# Altium schematic sheet OBDII-Ist.SchDoc
size A4; PageSetup: Record=PageOptions|CenterHorizontal=True|CenterVertical=True|PrintScale=1.00|XCorrection=1.00|YCorrection=1.00|PrintKind=1|BorderSize=5000000|LeftOffset=0|BottomOffset=0|Orientation=2|PaperLength=1000|PaperWidth=1000|Scale=100|PaperSource=15|PrintQuality=1200|MediaType=1|DitherType=10|PaperKind=A4|PrintScaleMode=1
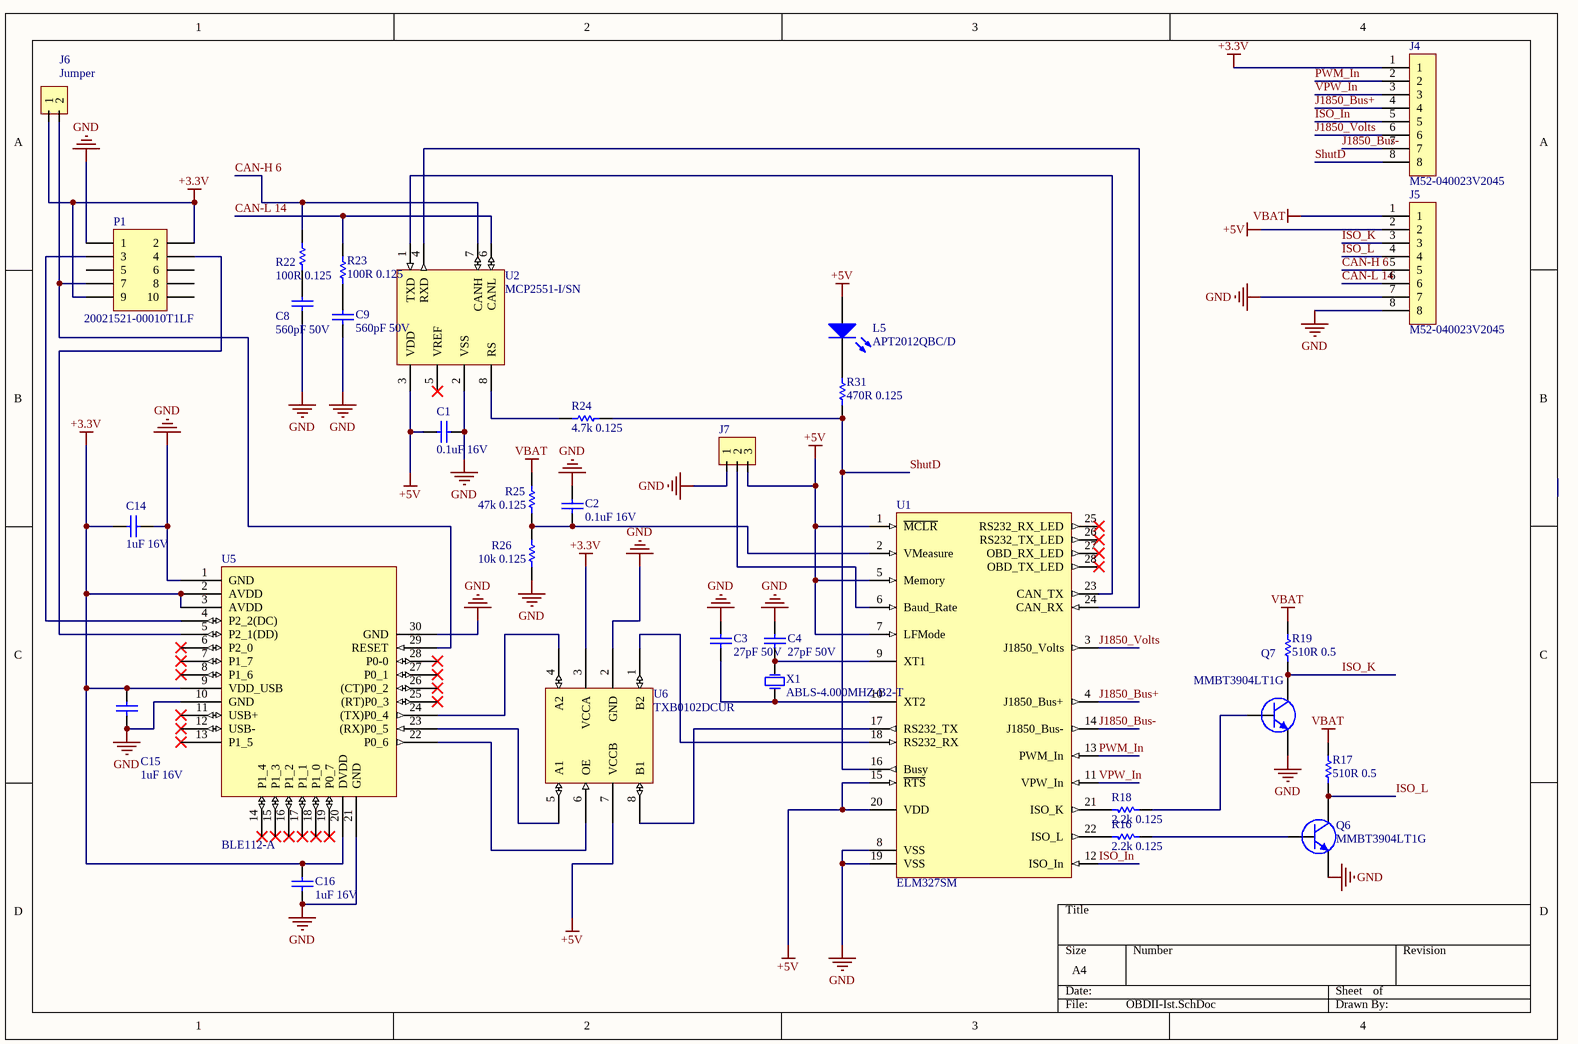
[diagram p0: OBDII-Ist.SchDoc]

## Parts
C1  0.1uF 16V  [1608[0603]]
C2  0.1uF 16V  [1608[0603]]
C3  27pF 50V  [1608[0603]]
C4  27pF 50V  [1608[0603]]
C8  560pF 50V  [0402]
C9  560pF 50V  [0402]
C14  1uF 16V  [1608[0603]]
C15  1uF 16V  [1608[0603]]
C16  1uF 16V  [1608[0603]]
J4  M52-040023V2045  [M52-040023V2045_hols]
J5  M52-040023V2045  [M52-040023V2045_hols]
J6  Jumper  [Jumper]
J7  Solder Junper Switcher  [Jumper-3]  (value not drawn)
L5  APT2012QBC/D  [LED-0805]
P1  20021521-00010T1LF  [20021521-00010T1LF]
Q6  MMBT3904LT1G  [SOT23]
Q7  MMBT3904LT1G  [SOT23]
R16  2.2k 0.125  [ERA-0805]
R17  510R 0.5  [ERJ-1210]
R18  2.2k 0.125  [ERA-0805]
R19  510R 0.5  [ERJ-1210]
R22  100R 0.125  [ERA-0805]
R23  100R 0.125  [ERA-0805]
R24  4.7k 0.125  [ERA-0805]
R25  47k 0.125  [ERA-0805]
R26  10k 0.125  [ERA-0805]
R31  470R 0.125  [ERA-0805]
U1  ELM327SM  [SOIC-28N]
U2  MCP2551-I/SN  [SOIC8N]
U5  BLE112-A  [BLE112-A - II]
U6  TXB0102DCUR  [TXB0102DCUR]
X1  ABLS-4.000MHZ-B2-T  [HC-49/US]

## Nets
+3.3V: C14.1 C15.2 C16.2 J4.1 J6.1 P1.2 P1.9 U5.2(AVDD) U5.3(AVDD) U5.9(VDD_USB) U5.20(DVDD) U6.3(VCCA)
+5V: C1.1 J5.2 J7.3 L5.1(A) U1.1(~{MCLR}) U1.5(Memory) U1.7(LFMode) U1.15(~{RTS}) U1.20(VDD) U2.3(VDD) U6.7(VCCB)
GND: C1.2 C2.2 C3.2 C4.2 C8.1 C9.1 C14.2 C15.1 C16.1 J5.7 J5.8 J7.1 P1.1 Q6.2(E) Q7.2(E) R26.1 U1.8(VSS) U1.19(VSS) U2.2(VSS) U5.1(GND) U5.10(GND) U5.21(GND) U5.30(GND) U6.2(GND)
VBAT: J5.1 R17.2 R19.2 R25.2
CAN-H 6: J5.5 R22.2 U2.7(CANH)
CAN-L 14: J5.6 R23.2 U2.6(CANL)
ISO_In: J4.5 U1.12(ISO_In)
ISO_K: J5.3 Q7.3(C) R19.1
ISO_L: J5.4 Q6.3(C) R17.1
J1850_Bus+: J4.4 U1.4(J1850_Bus+)
J1850_Bus-: J4.7 U1.14(J1850_Bus-)
J1850_Volts: J4.6 U1.3(J1850_Volts)
PWM_In: J4.2 U1.13(PWM_In)
ShutD: J4.8 R24.2 R31.1 U1.16(Busy)
VPW_In: J4.3 U1.11(VPW_In)
NetC2_1: C2.1 R25.1 R26.2 U1.2(VMeasure)
NetC3_1: C3.1 U1.10(XT2) X1.1(OSC1)
NetC4_1: C4.1 U1.9(XT1) X1.2(OSC2)
NetC8_2: C8.2 R22.1
NetC9_2: C9.2 R23.1
NetJ6_2: J6.2 P1.7 U5.29(RESET)
NetJ7_2: J7.2 U1.6(Baud_Rate)
NetL5_2: L5.2(K) R31.2
NetP1_3: P1.3 U5.4(P2_2(DC))
NetP1_4: P1.4 U5.5(P2_1(DD))
NetQ6_1: Q6.1(B) R16.1
NetQ7_1: Q7.1(B) R18.1
NetR16_2: R16.2 U1.22(ISO_L)
NetR18_2: R18.2 U1.21(ISO_K)
NetR24_1: R24.1 U2.8(RS)
NetU1_17: U1.17(RS232_TX) U6.8(B1)
NetU1_18: U1.18(RS232_RX) U6.1(B2)
NetU1_23: U1.23(CAN_TX) U2.1(TXD)
NetU1_24: U1.24(CAN_RX) U2.4(RXD)
NetU5_22: U5.22(P0_6) U6.6(OE)
NetU5_23: U5.23((RX)P0_5) U6.5(A1)
NetU5_24: U5.24((TX)P0_4) U6.4(A2)

Not connected (* = marked no-connect by the designer): P1 5 6 8 10; U1 25(RS232_RX_LED)* 26(RS232_TX_LED)* 27(OBD_RX_LED)* 28(OBD_TX_LED)*; U2 5(VREF)*; U5 6(P2_0)* 7(P1_7)* 8(P1_6)* 11(USB+)* 12(USB-)* 13(P1_5)* 14(P1_4)* 15(P1_3)* 16(P1_2)* 17(P1_1)* 18(P1_0)* 19(P0_7)* 25((RT)P0_3)* 26((CT)P0_2)* 27(P0_1)* 28(P0-0)*

## Library data of the parts
C1 C2 = GRM188R61C104KA01D: Surface-Mount Ceramic Multilayer Capacitor, 0.1uF, X5R, 10% Tolerance, 0603 Size, 16V; PackageReference: 0603; Publisher: Altium Limited; PackageDescription: Chip Capacitor; Site: http://product.tdk.com/capacitor/mlcc/en/documents/mlccspec_automotive_general_midvoltage_en.pdf; Value: 0.1uF 16V
C3 C4 = CC0603JRNPO9BN270: Surface-Mount Ceramic Multilayer Capacitor, 27pF, 5% Tolerance, 0603 Size, 50V; PackageReference: 1608(0603); Publisher: Altium Limited; PackageDescription: Chip Capacitor; Site: http://www.mouser.com/ds/2/447/UPY-GP_NP0_16V-to-50V_%288%29-217813.pdf; Value: 27pF 50V
C8 C9 = C0402C561J5GACTU: Surface-Mount Ceramic Multilayer Capacitor, 560pF, 5% Tolerance, 0402 Size, 50V; PackageReference: 0402; Publisher: Altium Limited; PackageDescription: Chip Capacitor; Site: http://www.kemet.com/kemet/web/homepage/kechome.nsf/vapubfiles/KEM_C1003_C0G_SMD.pdf/$file/KEM_C1003_C0G_SMD.pdf; Value: 560pF 50V
C14-C16 = C1608X7R1C105K080AC: Surface-Mount Ceramic Multilayer Capacitor, 1uF, X7R, 10% Tolerance, 0603 Size, 16V; PackageReference: 1608(0603); PackageDescription: Chip Capacitor; Site: http://www.kemet.com/kemet/web/homepage/kechome.nsf/vapubfiles/KEM_C1002_X7R_SMD.pdf/$file/KEM_C1002_X7R_SMD.pdf; Value: 1uF 16V
J4 J5 = M52-040023V2045_hols: CONN HEADER .050" 8POS PCB GOLD; Manufacturer: Harwin; PartNumber: M52-040023V2045; Type: M52-040023V2045_hols
J6 = Jumper: Solder Jumper; Type: Solder Junper
J7 = Jumper-3: Solder Jumper Switcher; Type: Solder Junper Switcher
L5 = APT2012QBC/D: Typical BLUE SiC LED; LatestRevisionNote: PCB Footprint replaced.; PackageReference: 0805; PackageDescription: SM LED; Body 2.0x 1.25 x 0.75mm, inc leads (LxWxH typ); Type: APT2012QBC/D
P1 = 20021521-00010T1LF: Header, 5-Pin, Dual row,SMT SHOULDED; LatestRevisionDate: 17-Jul-2002; LatestRevisionNote: Re-released for DXP Platform.; Publisher: Altium Limited; Type: 20021521-00010T1LF
Q6 Q7 = MMBT3904LT1G: NPN 3904 General Purpose Amplifier; Manufacturer: ON Semiconductor; Value: 0.2A, 40V; Approved: Yes by Implemenation; TargetLibrary: Transistors; Published: 8/13/2009; Publisher: Vanteon; LeadFree: Yes; RoHS: Yes; PartNumber: MMBT3904LT1G; ComponentLink1Description: Datasheet; ComponentLink1URL: http://www.onsemi.com/pub_link/Collateral/MMBT3904LT1-D.PDF; Status: Active; Supplier 1: Digi-Key; Supplier Part Number 1: MMBT3904LT1GOSCT-ND
R16 R18 = ERA-6AEB222V: Rectangular Thick Film Chip Resistor, 2.2 kOhm, 0.1% Tolerance, 0805 Size, 0.125 W; Note: If flow soldering, adjust pad width of PCB Footprint to 0.7 - 0.8 times the width of the resistor.; LatestRevisionNote: Silkscreen size reduced.; PackageReference: ERA-0805; Code_IPC: 2012 [0805]; ComponentLink1Description: Manufacturer Link; ComponentLink1URL: http://industrial.panasonic.com/www-data/pdf/AOA0000/AOA0000CE26.pdf; Value: 2.2k 0.125
R17 R19 = ERJ-14NF5100U: Rectangular Thick Film Chip Resistor, 510 Ohm, 1% Tolerance, 1210 Size, 0.5 W; Note: If flow soldering, adjust pad width of PCB Footprint to 0.7 - 0.8 times the width of the resistor.; LatestRevisionNote: Silkscreen size reduced.; PackageReference: ERA-1210; Code_IPC: 2012 [1210]; ComponentLink1Description: Manufacturer Link; ComponentLink1URL: http://industrial.panasonic.com/www-data/pdf/AOA0000/AOA0000CE26.pdf; Value: 510R 0.5
R22 R23 = ERA-6AEB101V: Rectangular Thick Film Chip Resistor, 100 Ohm, 0.1% Tolerance, 0805 Size, 0.125 W; Note: If flow soldering, adjust pad width of PCB Footprint to 0.7 - 0.8 times the width of the resistor.; LatestRevisionNote: Silkscreen size reduced.; PackageReference: ERA-0805; Code_IPC: 2012 [0805]; ComponentLink1Description: Manufacturer Link; ComponentLink1URL: http://industrial.panasonic.com/www-data/pdf/AOA0000/AOA0000CE26.pdf; Value: 100R 0.125
R24 = ERA-6AEB472V: Rectangular Thick Film Chip Resistor, 4.7 kOhm, 0.1% Tolerance, 0805 Size, 0.125 W; Note: If flow soldering, adjust pad width of PCB Footprint to 0.7 - 0.8 times the width of the resistor.; LatestRevisionNote: Silkscreen size reduced.; PackageReference: ERA-0805; Code_IPC: 2012 [0805]; ComponentLink1Description: Manufacturer Link; ComponentLink1URL: http://industrial.panasonic.com/www-data/pdf/AOA0000/AOA0000CE26.pdf; Value: 4.7k 0.125
R25 = ERA-6AEB473V: Rectangular Thick Film Chip Resistor, 47 kOhm, 0.1% Tolerance, 0805 Size, 0.125 W; Note: If flow soldering, adjust pad width of PCB Footprint to 0.7 - 0.8 times the width of the resistor.; LatestRevisionNote: Silkscreen size reduced.; PackageReference: ERA-0805; Code_IPC: 2012 [0805]; ComponentLink1Description: Manufacturer Link; ComponentLink1URL: http://industrial.panasonic.com/www-data/pdf/AOA0000/AOA0000CE26.pdf; Value: 47k 0.125
R26 = ERA-6AEB103V: Rectangular Thick Film Chip Resistor, 10 kOhm, 0.1% Tolerance, 0805 Size, 0.125 W; Note: If flow soldering, adjust pad width of PCB Footprint to 0.7 - 0.8 times the width of the resistor.; LatestRevisionNote: Silkscreen size reduced.; PackageReference: ERA-0805; Code_IPC: 2012 [0805]; ComponentLink1Description: Manufacturer Link; ComponentLink1URL: http://industrial.panasonic.com/www-data/pdf/AOA0000/AOA0000CE26.pdf; Value: 10k 0.125
R31 = ERA-6AEB471V: Rectangular Thick Film Chip Resistor, 470 Ohm, 0.1% Tolerance, 0805 Size, 0.125 W; Note: If flow soldering, adjust pad width of PCB Footprint to 0.7 - 0.8 times the width of the resistor.; LatestRevisionNote: Silkscreen size reduced.; PackageReference: ERA-0805; Code_IPC: 2012 [0805]; ComponentLink1Description: Manufacturer Link; ComponentLink1URL: http://industrial.panasonic.com/www-data/pdf/AOA0000/AOA0000CE26.pdf; Value: 470R 0.125
U1 = ELM327_SOIC: OBDII Interpreter IC; Manufacturer: Elm Electronics; PartNumber: ELM327SM; Type: ELM327SM
U2 = MCP2551-I/SN: IC TRANSCEIVER CAN HI-SPD 8-SOIC; Manufacturer: Microchip Technology; PartNumber: MCP2551-I/SN; Type: MCP2551-1/SN
U5 = BLE112-A: BLE112 Bluetooth Smart Module; Site: http://www.bluegiga.com/en-US/products/bluetooth-4.0-modules/ble112-bluetooth--smart-module/; Type: BLE112-A
U6 = TXB0102DCUR: 2-Bit Bidirectional Voltage-Level Translator with Auto Direction Sensing and +/-15-kV ESD Protect; Site: http://www.ti.com/lit/gpn/txb0102; Type: TXB0102DCUR
X1 = ABLS-4.000MHZ-B2-T: CRYSTAL 4.000 MHZ 18PF SMD; Manufacturer: Abracon; Value: 4MHz; PartNumber: ABLS-4.000MHZ-B2-T; Site: http://www.abracon.com/Resonators/abls.pdf